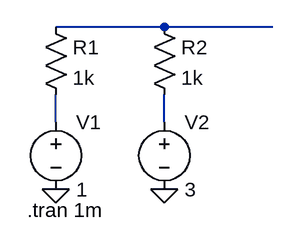
[diagram p0: schematic Dс.asc]
Dс.asc, the LTspice schematic file:
Version 4
SHEET 1 880 680
WIRE 224 32 96 32
WIRE 352 32 224 32
WIRE 96 144 96 112
WIRE 224 144 224 112
FLAG 96 224 0
FLAG 224 224 0
SYMBOL voltage 96 128 R0
WINDOW 123 0 0 Left 2
WINDOW 39 0 0 Left 2
SYMATTR InstName V1
SYMATTR Value 1
SYMBOL voltage 224 128 R0
SYMATTR InstName V2
SYMATTR Value 3
SYMBOL res 80 16 R0
SYMATTR InstName R1
SYMATTR Value 1k
SYMBOL res 208 16 R0
SYMATTR InstName R2
SYMATTR Value 1k
TEXT 62 248 Left 2 !.tran 1m

The netlist it stands for:
* Dс.asc
V1 N002 0 1
V2 N003 0 3
R1 N001 N002 1k
R2 N001 N003 1k
.tran 1m
.backanno
.end